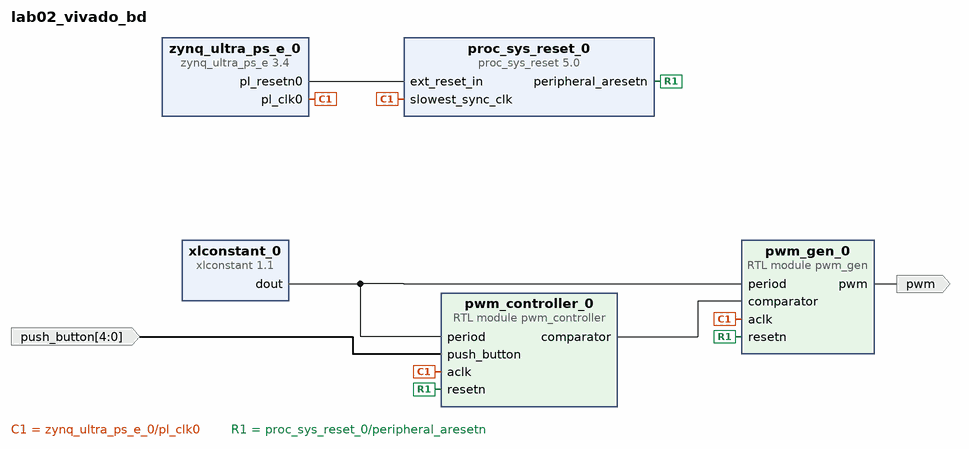
[diagram p0: block diagram of the top level]
# Vivado block design lab02_vivado_bd, xczu48dr-ffvg1517-2-e, Vivado 2022.2
create_bd_design lab02_vivado_bd

create_bd_port -dir I -from 4 -to 0 push_button
create_bd_port -dir O pwm

create_bd_cell -type module -reference pwm_gen pwm_gen_0
create_bd_cell -type module -reference pwm_controller pwm_controller_0
create_bd_cell -type ip -vlnv xilinx.com:ip:xlconstant:1.1 xlconstant_0
set_property -dict {CONFIG.CONST_VAL 10000 CONFIG.CONST_WIDTH 32} [get_bd_cells xlconstant_0]
create_bd_cell -type ip -vlnv xilinx.com:ip:zynq_ultra_ps_e:3.4 zynq_ultra_ps_e_0
set_property -dict [list \
  CONFIG.PSU__DDR_HIGH_ADDRESS_GUI_ENABLE 0 \
  CONFIG.PSU__PSS_REF_CLK__FREQMHZ 50 \
  CONFIG.PSU__USE__M_AXI_GP2 0 \
] [get_bd_cells zynq_ultra_ps_e_0]
# 25 more settings of zynq_ultra_ps_e_0 are not shown: defaults, MIO pin electricals, DDR timing, and values the tool derives
create_bd_cell -type ip -vlnv xilinx.com:ip:proc_sys_reset:5.0 proc_sys_reset_0

# ---- connections ----

connect_bd_net -net clk_wiz_0_clk100mhz [get_bd_pins zynq_ultra_ps_e_0/pl_clk0] \
  [get_bd_pins pwm_controller_0/aclk] [get_bd_pins pwm_gen_0/aclk] [get_bd_pins proc_sys_reset_0/slowest_sync_clk]
connect_bd_net [get_bd_pins proc_sys_reset_0/peripheral_aresetn] [get_bd_pins pwm_controller_0/resetn] [get_bd_pins pwm_gen_0/resetn]
connect_bd_net [get_bd_ports push_button] [get_bd_pins pwm_controller_0/push_button]
connect_bd_net [get_bd_pins pwm_controller_0/comparator] [get_bd_pins pwm_gen_0/comparator]
connect_bd_net [get_bd_pins pwm_gen_0/pwm] [get_bd_ports pwm]
connect_bd_net [get_bd_pins xlconstant_0/dout] [get_bd_pins pwm_controller_0/period] [get_bd_pins pwm_gen_0/period]
connect_bd_net [get_bd_pins zynq_ultra_ps_e_0/pl_resetn0] [get_bd_pins proc_sys_reset_0/ext_reset_in]

validate_bd_design
save_bd_design
